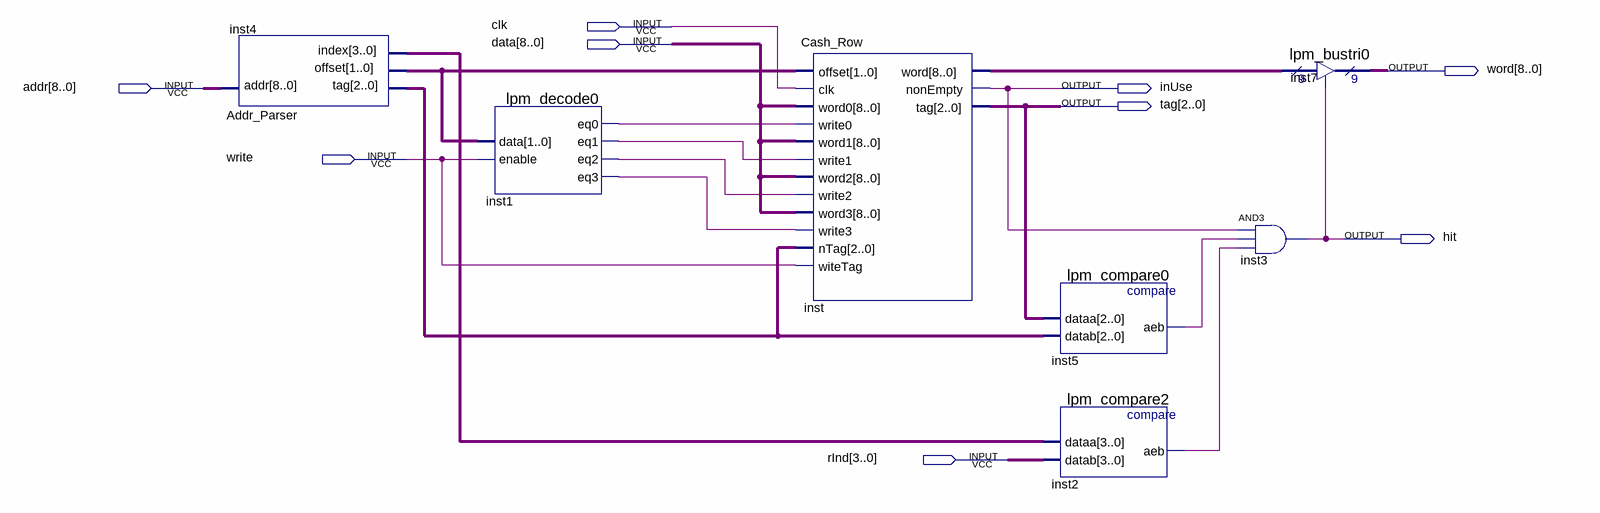
[diagram p0: schematic sheet]
// Quartus schematic Row_Facade.bdf as structural Verilog: 7 symbols, 9 pins
module Row_Facade (
  input  clk,
  input  [8:0] data,
  input  [8:0] addr,
  input  write,
  input  [3:0] rInd,
  output [8:0] word,
  output inUse,
  output [2:0] tag,
  output hit
);

  wire inst1_eq0, inst1_eq1, inst1_eq2, inst1_eq3, inst2_aeb, inst5_aeb;
  wire [1:0] inst4_offset;
  wire [2:0] inst4_tag;
  wire [3:0] inst4_index;
  wire [8:0] inst_word;

  Addr_Parser inst4 (.addr(addr), .tag(inst4_tag), .offset(inst4_offset), .index(inst4_index));
  lpm_decode0 inst1 (
    .data(inst4_offset), .enable(write), .eq0(inst1_eq0), .eq1(inst1_eq1), .eq2(inst1_eq2), .eq3(inst1_eq3));
  Cash_Row inst (
    .offset(inst4_offset), .clk(clk), .word0(data), .write0(inst1_eq0), .word1(data), .write1(inst1_eq1),
    .word2(data), .write2(inst1_eq2), .word3(data), .write3(inst1_eq3), .nTag(inst4_tag), .witeTag(write),
    .word(inst_word), .nonEmpty(inUse), .tag(tag));
  lpm_compare0 inst5 (.dataa(tag), .datab(inst4_tag), .aeb(inst5_aeb));
  lpm_compare2 inst2 (.dataa(inst4_index), .datab(rInd), .aeb(inst2_aeb));
  and inst3 (hit, inUse, inst5_aeb, inst2_aeb);
  lpm_bustri0 inst7 (.enabledt(hit), .data(inst_word), .tridata(word));
endmodule
